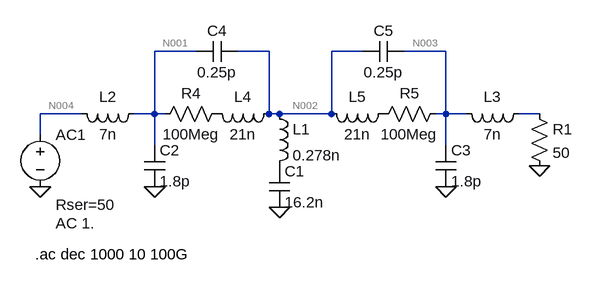
[diagram p0: schematic SHVFeedthroughFilter.asc]
SHVFeedthroughFilter.asc, the LTspice schematic file:
Version 4
SHEET 1 1000 680
WIRE 32 -80 -32 -80
WIRE 144 -80 96 -80
WIRE 288 -80 240 -80
WIRE 416 -80 352 -80
WIRE -144 16 -208 16
WIRE -32 16 -32 -80
WIRE -32 16 -64 16
WIRE -16 16 -32 16
WIRE 144 16 144 -80
WIRE 160 16 144 16
WIRE 240 16 240 -80
WIRE 240 16 160 16
WIRE 416 16 416 -80
WIRE 416 16 400 16
WIRE 448 16 416 16
WIRE 560 16 528 16
WIRE -208 48 -208 16
WIRE -32 64 -32 16
WIRE 416 64 416 16
FLAG -208 128 0
FLAG 160 160 0
FLAG 560 96 0
FLAG -32 128 0
FLAG 416 128 0
SYMBOL cap 144 96 R0
SYMATTR InstName C1
SYMATTR Value 16.2n
SYMBOL ind 144 0 R0
SYMATTR InstName L1
SYMATTR Value 0.278n
SYMBOL cap 96 -96 R90
WINDOW 0 0 32 VBottom 2
WINDOW 3 32 32 VTop 2
SYMATTR InstName C4
SYMATTR Value 0.25p
SYMBOL cap 352 -96 R90
WINDOW 0 0 32 VBottom 2
WINDOW 3 32 32 VTop 2
SYMATTR InstName C5
SYMATTR Value 0.25p
SYMBOL res 80 0 R90
WINDOW 0 0 56 VBottom 2
WINDOW 3 32 56 VTop 2
SYMATTR InstName R4
SYMATTR Value 100Meg
SYMBOL res 416 0 R90
WINDOW 0 0 56 VBottom 2
WINDOW 3 32 56 VTop 2
SYMATTR InstName R5
SYMATTR Value 100Meg
SYMBOL ind 160 0 R90
WINDOW 0 5 56 VBottom 2
WINDOW 3 32 56 VTop 2
SYMATTR InstName L4
SYMATTR Value 21n
SYMBOL ind -48 0 R90
WINDOW 0 5 56 VBottom 2
WINDOW 3 32 56 VTop 2
SYMATTR InstName L2
SYMATTR Value 7n
SYMBOL ind 544 0 R90
WINDOW 0 5 56 VBottom 2
WINDOW 3 32 56 VTop 2
SYMATTR InstName L3
SYMATTR Value 7n
SYMBOL ind 336 0 R90
WINDOW 0 5 56 VBottom 2
WINDOW 3 32 56 VTop 2
SYMATTR InstName L5
SYMATTR Value 21n
SYMBOL voltage -208 32 R0
WINDOW 3 24 152 Left 2
WINDOW 123 0 0 Left 0
WINDOW 39 24 124 Left 2
SYMATTR InstName AC1
SYMATTR Value AC 1.
SYMATTR SpiceLine Rser=50
SYMBOL res 544 0 R0
SYMATTR InstName R1
SYMATTR Value 50
SYMBOL cap -48 64 R0
SYMATTR InstName C2
SYMATTR Value 1.8p
SYMBOL cap 400 64 R0
SYMATTR InstName C3
SYMATTR Value 1.8p
TEXT -216 232 Left 2 !.ac dec 1000 10 100G

The netlist it stands for:
* SHVFeedthroughFilter.asc
C1 P001 0 16.2n
L1 N002 P001 0.278n
C4 N002 N001 0.25p
C5 N003 N002 0.25p
R4 P002 N001 100Meg
R5 N003 P003 100Meg
L4 N002 P002 21n
L2 N001 N004 7n
L3 N005 N003 7n
L5 P003 N002 21n
V§AC1 N004 0 AC 1. Rser=50
R1 N005 0 50
C2 N001 0 1.8p
C3 N003 0 1.8p
.ac dec 1000 10 100G
.backanno
.end

* Results of the author's LTspice run, read from the files saved beside the schematic
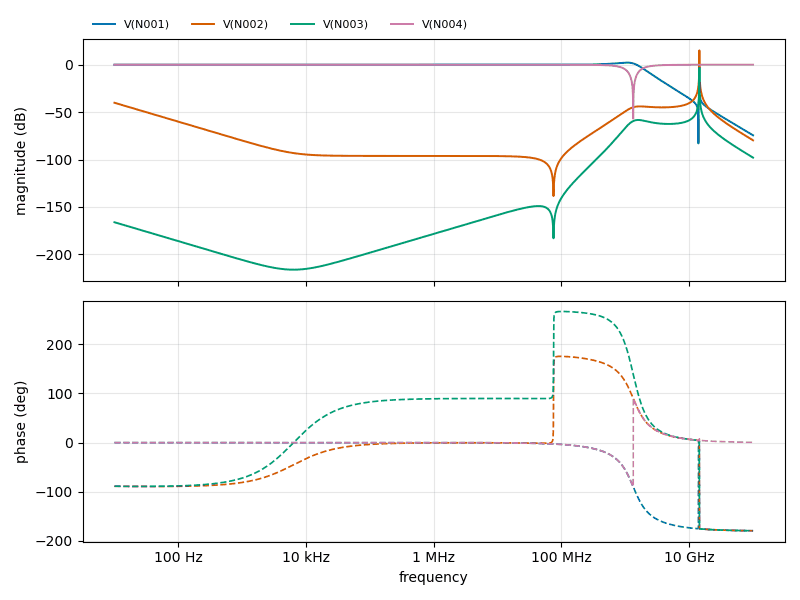
[diagram p1: AC Analysis of SHVFeedthroughFilter.asc, plotted from the saved traces]
* AC Analysis, 1 run:
*   V(N001): -0.00 dB at 10 Hz, -74.47 dB at 100 GHz, peak 2.23 dB at 1.057 GHz, 3 dB below the peak at 1.575 GHz
*   V(N002): -40.16 dB at 10 Hz, -79.77 dB at 100 GHz, peak 15.08 dB at 14.42 GHz, 3 dB below the peak at 14.41 GHz and 14.43 GHz
*   V(N003): -166.18 dB at 10 Hz, -98.05 dB at 100 GHz, peak -3.13 dB at 14.42 GHz, 3 dB below the peak at 14.41 GHz and 14.43 GHz
*   V(N004): -0.00 dB at 10 Hz, -0.00 dB at 100 GHz, peak -0.00 dB at 10.3 Hz, 3 dB below the peak at 876.5 MHz